# EAGLE design sparkfun-samd21-mini-breakout-v10 (EAGLE 9.5.2)
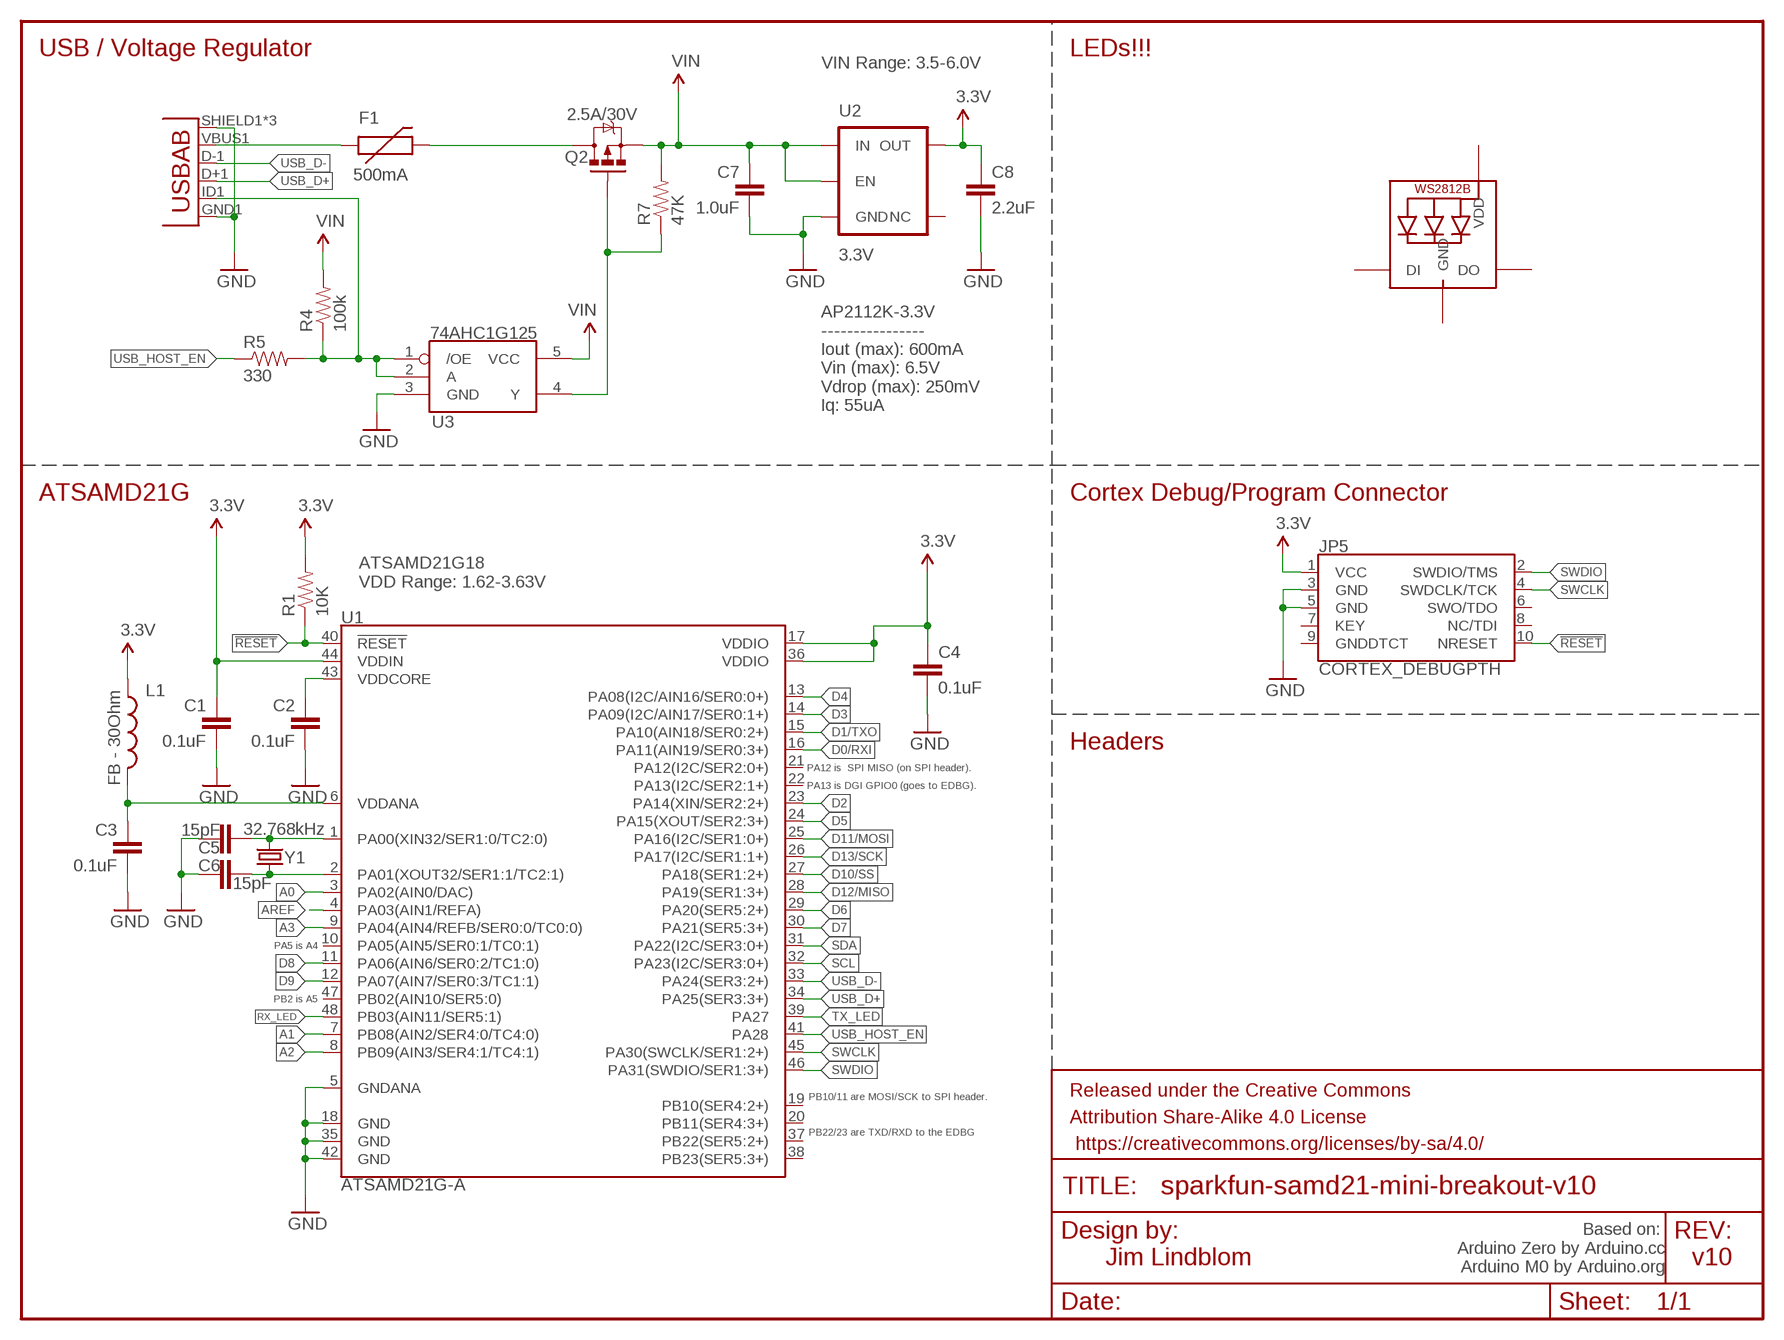
[diagram p0: schematic, sheet 1]

## Parts
C1  0.1uF  0.1UF-16V(+-10%)(0402)  [0402-CAP]
C2  0.1uF  0.1UF-16V(+-10%)(0402)  [0402-CAP]
C3  0.1uF  0.1UF-16V(+-10%)(0402)  [0402-CAP]
C4  0.1uF  0.1UF-16V(+-10%)(0402)  [0402-CAP]
C5  15pF  15PF-50V(+-5%)(0402)  [0402-CAP]
C6  15pF  15PF-50V(+-5%)(0402)  [0402-CAP]
C7  1.0uF  1.0UF-25V-+80/-20(0805)"  [0805-CAP]
C8  2.2uF  2.2UF-10V-20%(0603)  [0603-CAP]
F1  500mA  PTCSMD  [PTC-1206]
FRAME1  FRAME-LETTER  [CREATIVE_COMMONS]
JP3  USB-ABCONN-11794  [USB-AB-MICRO-SMD_V03]
JP5  CORTEX_DEBUGPTH  [2X5-PTH-1.27MM]
L1  FB - 30Ohm  INDUCTOR0603  [0603]
LED1  WS2812B3535  [LED3535]
Q2  2.5A/30V  MOSFET-PCHANNELDMG2307L  [SOT23-3]
R1  10K  10KOHM-1/10W-1%(0603)0603  [0603-RES]
R4  100k  100KOHM-1/10W-1%(0603)  [0603-RES]
R5  330  330OHM1/10W1%(0603)  [0603-RES]
R7  47K  47KOHM1/10W1%(0603)  [0603-RES]
U1  ATSAMD21G-A  [TQFP-48]
U2  3.3V  V_REG_AP2112K-3.3V  [SOT23-5]
U3  74AHC1G125  [SOT23-5]
Y1  32.768kHz  CRYSTAL3.2X1.5MM  [CRYSTAL-SMD-3.2X1.5MM]

## Nets
3.3V: C1.1 C4.1 C8.1 JP5.1(VCC) L1.1 R1.2 U1.17(VDDIO) U1.36(VDDIO) U1.44(VDDIN) U2.5(OUT)
!RESET: JP5.10(NRESET) R1.1 U1.40(!RESET!)
A0: U1.3(PA02(AIN0/DAC))
A1: U1.7(PB08(AIN2/SER4:0/TC4:0))
A2: U1.8(PB09(AIN3/SER4:1/TC4:1))
A3: U1.9(PA04(AIN4/REFB/SER0:0/TC0:0))
AREF: U1.4(PA03(AIN1/REFA))
D0/RXI: U1.16(PA11(AIN19/SER0:3+))
D1/TXO: U1.15(PA10(AIN18/SER0:2+))
D2: U1.23(PA14(XIN/SER2:2+))
D3: U1.14(PA09(I2C/AIN17/SER0:1+))
D4: U1.13(PA08(I2C/AIN16/SER0:0+))
D5: U1.24(PA15(XOUT/SER2:3+))
D6: U1.29(PA20(SER5:2+))
D7: U1.30(PA21(SER5:3+))
D8: U1.11(PA06(AIN6/SER0:2/TC1:0))
D9: U1.12(PA07(AIN7/SER0:3/TC1:1))
D10/SS: U1.27(PA18(SER1:2+))
D11/MOSI: U1.25(PA16(I2C/SER1:0+))
D12/MISO: U1.28(PA19(SER1:3+))
D13/SCK: U1.26(PA17(I2C/SER1:1+))
GND: C1.2 C2.2 C3.2 C4.2 C5.1 C6.2 C7.2 C8.2 JP3.GND1(GND) JP3.SHIELD1(SHIELD) JP3.SHIELD2(SHIELD) JP3.SHIELD3(SHIELD) JP5.3(GND) JP5.5(GND) U1.5(GNDANA) U1.18(GND) U1.35(GND) U1.42(GND) U2.2(GND) U3.3(GND)
N$1: F1.1 JP3.VBUS1(VBUS)
N$2: C5.2 U1.1(PA00(XIN32/SER1:0/TC2:0)) Y1.P$2
N$4: C6.1 U1.2(PA01(XOUT32/SER1:1/TC2:1)) Y1.P$1
N$7: F1.2 Q2.3(D)
N$8: JP3.ID1(USBID) R4.1 R5.2 U3.1(/OE) U3.2(A)
N$9: Q2.1(G) R7.1 U3.4(Y)
RX_LED: U1.48(PB03(AIN11/SER5:1))
SCL: U1.32(PA23(I2C/SER3:0+))
SDA: U1.31(PA22(I2C/SER3:0+))
SWCLK: JP5.4(SWDCLK/TCK) U1.45(PA30(SWCLK/SER1:2+))
SWDIO: JP5.2(SWDIO/TMS) U1.46(PA31(SWDIO/SER1:3+))
TX_LED: U1.39(PA27)
USB_D+: JP3.D+1(D+) U1.34(PA25(SER3:3+))
USB_D-: JP3.D-1(D-) U1.33(PA24(SER3:2+))
USB_HOST_EN: R5.1 U1.41(PA28)
VDDANA: C3.1 L1.2 U1.6(VDDANA)
VDDCORE: C2.1 U1.43(VDDCORE)
VIN: C7.1 Q2.2(S) R4.2 R7.2 U2.1(IN) U2.3(EN) U3.5(VCC)
Unconnected: JP5.6(SWO/TDO) JP5.7(KEY) JP5.8(NC/TDI) JP5.9(GNDDTCT) LED1.1(DI) LED1.3(DO) U1.10(PA05(AIN5/SER0:1/TC0:1)) U1.19(PB10(SER4:2+)) U1.20(PB11(SER4:3+)) U1.21(PA12(I2C/SER2:0+)) U1.22(PA13(I2C/SER2:1+)) U1.37(PB22(SER5:2+)) U1.38(PB23(SER5:3+)) U1.47(PB02(AIN10/SER5:0)) U2.4(NC)

## Notes on the sheet
- USB / Voltage Regulator | LEDs!!!
- VIN Range: 3.5-6.0V
- AP2112K-3.3V
  ----------------
  Iout (max): 600mA 
  Vin (max): 6.5V
  Vdrop (max): 250mV
  Iq: 55uA
- ATSAMD21G | Cortex Debug/Program Connector
- ATSAMD21G18
  VDD Range: 1.62-3.63V
- Headers
- PA12 is  SPI MISO (on SPI header).
- PA13 is DGI GPIO0 (goes to EDBG).
- PA5 is A4
- PB2 is A5
- PB10/11 are MOSI/SCK to SPI header.
- PB22/23 are TXD/RXD to the EDBG
- Based on: 
  Arduino Zero by Arduino.cc
  Arduino M0 by Arduino.org
- Jim Lindblom | v10

## Power pins joined to a net without a drawn wire
GND: LED1.4(GND)
VDD: LED1.2(VDD)

## Library data of the parts
C1-C4 = SparkFun-Capacitors:0.1UF-16V(+-10%)(0402); PROD_ID: CAP-12416
C5 C6 = samd21-temp:15PF-50V(+-5%)(0402); PROD_ID: CAP-13063
C7 = SparkFun-Capacitors:1.0UF-25V-+80/-20(0805): CAP-11625; PROD_ID: CAP-11625
C8 = SparkFun-Capacitors:2.2UF-10V-20%(0603): CAP-07888; PROD_ID: CAP-07888
F1 = SparkFun-PowerIC:PTC: Resettable Fuse PTC Resettable Fuse. Spark Fun Electronics SKU : COM-08357; PROD_ID: RES-11150
FRAME1 = SparkFun-Aesthetics:FRAME-LETTER: Schematic Frame Standard 8.5x11 US Letter frame
JP3 = SparkFun-Connectors:USB-AB: This is a USB AB connector that is compatible with USB OTG. i.e. this connector can serve as a host or device; PROD_ID: CONN-11794
JP5 = samd21-temp:CORTEX_DEBUG: Cortex Debug Connector Datasheet <http://infocenter.arm.com/help/topic/com.arm.doc.faqs/attached/13634/cortex_debug_connectors.pdf>
L1 = SparkFun-Passives:INDUCTOR: Inductors Basic Inductor/Choke - 0603 and 1206. Footprints are not proven and vary greatly between part numbers. INDUCTOR POWER 3.3UH 4.0A SMD 0.197" L x 0.197" W x 0.177" H (5.00mm x 5.00mm x 4.50mm); PROD_ID: RES-07859
LED1 = adafruit:WS2812B
Q2 = SparkFun-DiscreteSemi:MOSFET-PCHANNEL: Generic PMOSFET IRLML2244 - TRANS-11153 (SOT-23 -20V -4.3A) (1.Gate 2.Source 3.Drain) FQP27P06 - COM-10349 <http://www.sparkfun.com/products/10349> (TO-220 -60V -27A) (1.Gate 2.Source 3.Drain); PROD_ID: TRANS-11308
R1 = SparkFun-Resistors:10KOHM-1/10W-1%(0603): RES-00824; PROD_ID: RES-00824
R4 = SparkFun-Resistors:100KOHM-1/10W-1%(0603): RES-07828; PROD_ID: RES-07828
R5 = SparkFun-Resistors:330OHM1/10W1%(0603): RES-00818; PROD_ID: RES-00818
R7 = SparkFun-Resistors:47KOHM1/10W1%(0603): RES-07871; PROD_ID: RES-07871
U1 = samd21-temp:ATSAMD21G: Atmel SAMD21G SMART ARM-Based Microcontroller The Atmel ® | SMART ™ SAM D21 is a series of low-power microcontrollers using the 32-bit ARM ® Cortex ® -M0+ processor, and ranging from 32- to 64-pins with up to 256KB Flash and 32KB of SRAM. The SAM D21 devices operate at a maximum frequency of 48MHz and reach 2.46 CoreMark/MHz. They are designed for simple and intuitive migration with identical peripheral modules, hex compatible code, identical linear address map and pin compatible migration paths between all devices in the product series. All devices include intelligent and flexible peripherals, Atmel Event System for inter-peripheral signaling, and support for capacitive touch button, slider and wheel user interfaces.; PROD_ID: IC-13064
U2 = SparkFun-PowerIC:V_REG_AP2112: AP2112 - 600mA CMOS LDO Regulator w/ Enable The AP2112 is CMOS process low dropout linear regulator with enable function, the regulator delivers a guaranteed 600mA (min.) continuous load current. Features Output Voltage Accuracy: ±1.5% Output Current: 600mA (Min.) Foldback Short Current Protection: 50mA Enable Function to Turn ON/OFF VOUT Low Dropout Voltage (3.3V): 250mV (Typ.) @IOUT=600mA Excellent Load Regulation: 0.2%/A (Typ.) Excellent Line Regulation: 0.02%/V (Typ.) Low Quiescent Current: 55μA (Typ.) Low Standby Current: 0.01μA (Typ.) Low Output Noise: 50μVRMS PSRR: 100Hz -65dB, 1kHz -65dB OTSD Protection Stable with 1.0μF Flexible Cap: Ceramic, Tantalum and Aluminum Electrolytic Operation Temperature Range: -40°C to 85°C ESD: MM 400V, HBM 4000V; PROD_ID: VREG-12457
U3 = SparkFun-DigitalIC:74AHC1G125: Single bus buffer gate with 3-state output; PROD_ID: IC-11920
Y1 = samd21-temp:CRYSTAL: Various standard crystals. Proven footprints.; PROD_ID: XTAL-13062

## Board
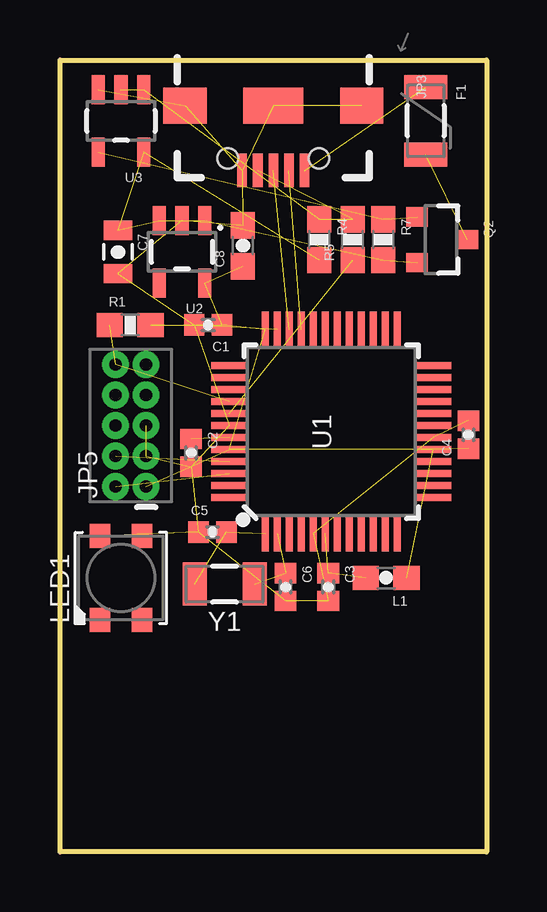
[diagram p1: board, top side]
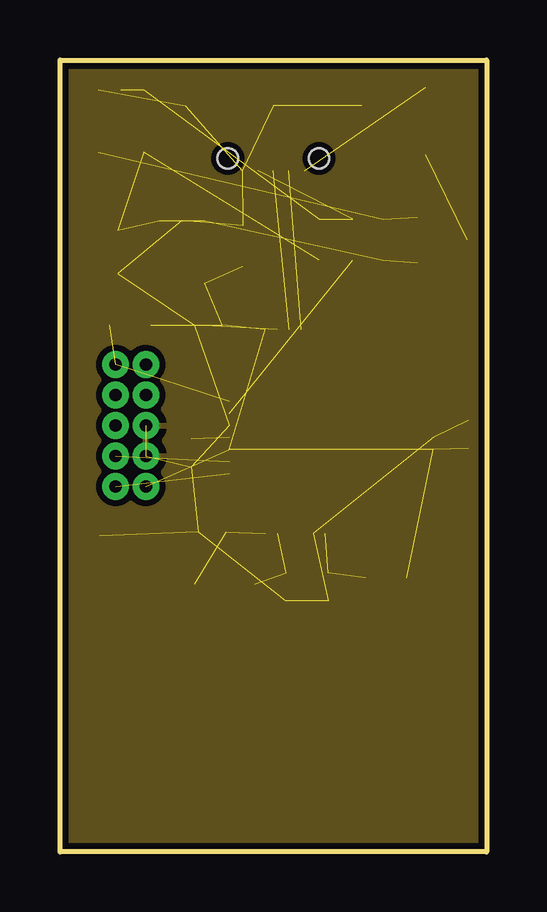
[diagram p2: board, inner layer Route2]
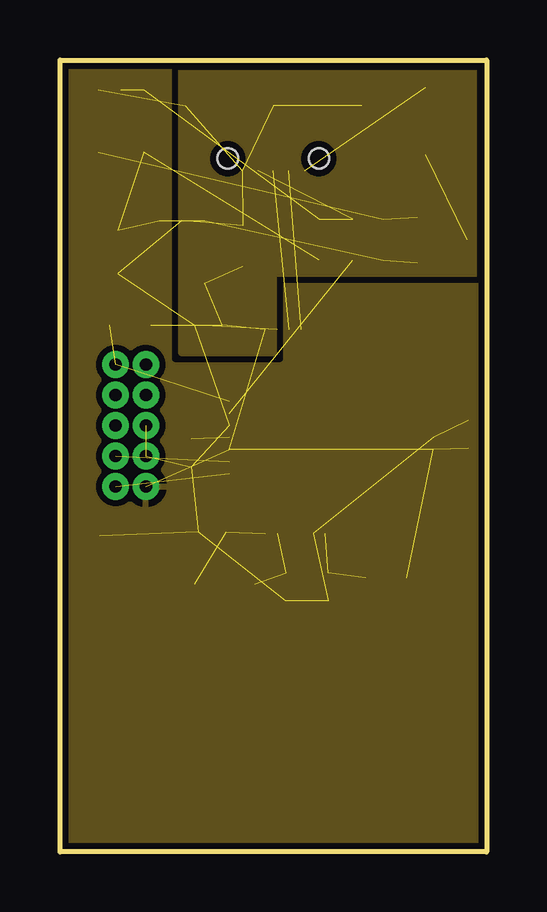
[diagram p3: board, inner layer Route15]

Size 17.78 x 33.02 mm. Coordinates in mm from the lower left corner, seen from the top.
Outline: 0,0 0,33.02 17.78,33.02 17.78,0 0,0
Copper layers (1*2*15*16): Top 0.035mm / dielectric 1.5mm / Route2 0.035mm / dielectric 0.15mm / Route15 0.035mm / dielectric 0.2mm / Bottom 0.035mm
Design rules "SparkFun-4-layer *": minimum track width 6mil, minimum drill 10mil, track to track 6mil, track to pad 6mil, pad to pad 6mil, via to via 6mil, smd to smd 6mil, copper to edge 6mil, drill to drill 8mil, minimum pad ring 12mil, minimum via ring 10mil, stop-mask expansion 4mil, vias tented up to drill 20mil, thermal gap 12mil

### Footprints (pad centres in the part's own frame; a part is rotated, then mirrored left to right if it is on the bottom)
0402-CAP = smd 0.85 x 0.9: 1 -0.58,0; 2 0.58,0
0805-CAP = smd 0.8 x 1.2: 1 -0.9,0; 2 0.9,0
0603-CAP = smd 1.1 x 1: 1 -0.85,0; 2 0.85,0
PTC-1206 = smd 1 x 1.8: 1 -1.4,0; 2 1.4,0
USB-AB-MICRO-SMD_V03 = smd 1.4 x 0.4: D+1 2.7,0; D-1 2.7,0.65; GND1 2.7,-1.3; ID1 2.7,-0.65; VBUS1 2.7,1.3 | smd 1.5 x 1.8: SHIELD1 0,3.68; SHIELD3 0,-3.68 | smd 1.5 x 2.5: SHIELD2 0,0 | hole 0.85: 2.2,1.9; 2.2,-1.9
2X5-PTH-1.27MM = drill 0.508 pad 1: 1 -2.54,-0.635; 2 -2.54,0.635; 3 -1.27,-0.635; 4 -1.27,0.635; 5 0,-0.635; 6 0,0.635; 7 1.27,-0.635; 8 1.27,0.635; 9 2.54,-0.635; 10 2.54,0.635
0603 = smd 1.1 x 1: 1 -0.85,0; 2 0.85,0
LED3535 = smd 1 x 0.85: 1 -1.75,0.875; 2 -1.75,-0.875; 3 1.75,-0.875; 4 1.75,0.875
SOT23-3 = smd 0.8 x 0.9: 1 -0.95,-1; 2 0.95,-1; 3 0,1.1
0603-RES = smd 1.1 x 1: 1 -0.85,0; 2 0.85,0
TQFP-48 = smd 1.5 x 0.28: 1 -4.25,2.75; 2 -4.25,2.25; 3 -4.25,1.75; 4 -4.25,1.25; 5 -4.25,0.75; 6 -4.25,0.25; 7 -4.25,-0.25; 8 -4.25,-0.75; 9 -4.25,-1.25; 10 -4.25,-1.75; 11 -4.25,-2.25; 12 -4.25,-2.75; 25 4.25,-2.75; 26 4.25,-2.25; 27 4.25,-1.75; 28 4.25,-1.25; 29 4.25,-0.75; 30 4.25,-0.25; 31 4.25,0.25; 32 4.25,0.75; 33 4.25,1.25; 34 4.25,1.75; 35 4.25,2.25; 36 4.25,2.75 | smd 0.28 x 1.5: 13 -2.75,-4.25; 14 -2.25,-4.25; 15 -1.75,-4.25; 16 -1.25,-4.25; 17 -0.75,-4.25; 18 -0.25,-4.25; 19 0.25,-4.25; 20 0.75,-4.25; 21 1.25,-4.25; 22 1.75,-4.25; 23 2.25,-4.25; 24 2.75,-4.25; 37 2.75,4.25; 38 2.25,4.25; 39 1.75,4.25; 40 1.25,4.25; 41 0.75,4.25; 42 0.25,4.25; 43 -0.25,4.25; 44 -0.75,4.25; 45 -1.25,4.25; 46 -1.75,4.25; 47 -2.25,4.25; 48 -2.75,4.25
SOT23-5 = smd 0.55 x 1.2: 1 -0.95,-1.3; 2 0,-1.3; 3 0.95,-1.3; 4 0.95,1.3; 5 -0.95,1.3
CRYSTAL-SMD-3.2X1.5MM = smd 1 x 1.8: P$1 -1.25,0; P$2 1.25,0

### Placement (x,y rotation side)
C1  6.17,21.97 180 top
C2  5.46,16.64 270 top
C3  11.18,11.05 270 top
C4  17.02,17.4 90 top
C5  6.35,13.34 0 top
C6  9.4,11.05 270 top
C7  2.41,25.02 270 top
C8  7.62,25.27 90 top
F1  15.24,30.48 270 top
FRAME1  -12.7,-19.05 0 top  (outside the outline)
JP3  8.89,31.11 270 top
JP5  2.95,17.78 90 top
L1  13.59,11.43 180 top
LED1  2.54,11.43 90 top
Q2  15.88,25.53 270 top
R1  2.92,21.97 0 top
R4  10.79,25.53 270 top
R5  12.19,25.53 90 top
R7  13.46,25.53 270 top
U1  11.3,17.53 90 top
U2  5.08,25.02 180 top
U3  2.54,30.48 180 top
Y1  6.86,11.18 180 top

### Tracks (layer width: path | path; a pad name or v marks a point on that pad's centre or on a via)
3.3V  (9 unrouted)
  pour Route15 (isolate 0.254, rank 3): 0,33.02 0,0 17.78,0 17.78,33.02
!RESET  (2 unrouted)
GND  (20 unrouted)
  pour Route2 (isolate 0.254): 0,33.02 0,0 17.78,0 17.78,33.02
N$1  (1 unrouted)
N$2  (2 unrouted)
N$4  (2 unrouted)
N$7  (1 unrouted)
N$8  (4 unrouted)
N$9  (2 unrouted)
SWCLK  (1 unrouted)
SWDIO  (1 unrouted)
USB_D+  (1 unrouted)
USB_D-  (1 unrouted)
USB_HOST_EN  (1 unrouted)
VDDANA  (2 unrouted)
VDDCORE  (1 unrouted)
VIN  (6 unrouted)
  pour Route15 (isolate 0.305, rank 2): 5.08,33.02 5.08,20.83 8.89,20.83 8.89,24.13 17.78,24.13 17.78,33.02

### Text on the board
Measures: Units in inches
tDocu: Jim Lindblom